# EAGLE design Old Shutter Driver with DMUX (EAGLE 9.0.0)
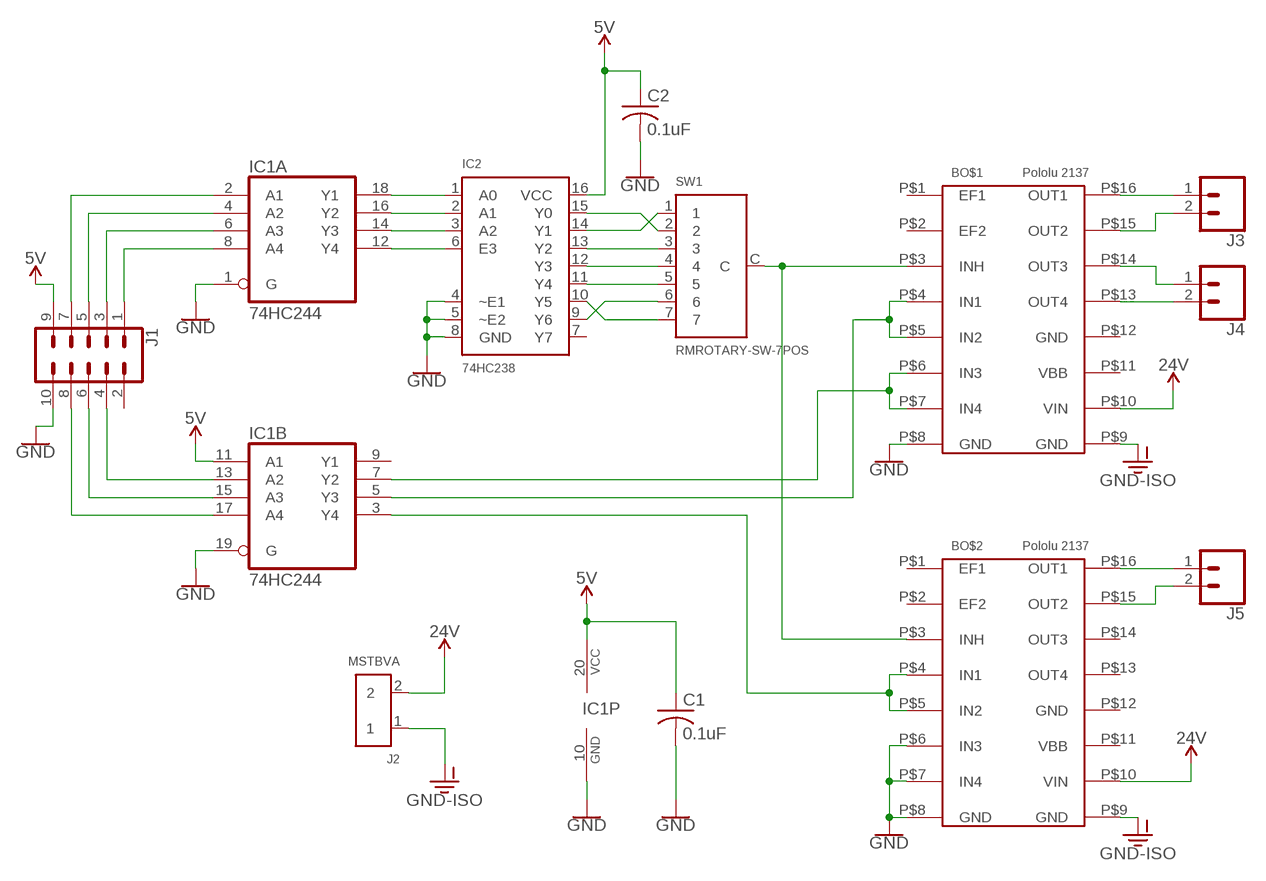
[diagram p0: schematic, sheet 1]

## Parts
BO$1  Pololu 2137  POLOLU2137  [POLOLU2137]
BO$2  Pololu 2137  POLOLU2137  [POLOLU2137]
C1  0.1uF  C-USC0805  [C0805]
C2  0.1uF  C-USC0805  [C0805]
IC1  74HC244  74LS244DW  [SO20W]
IC2  74HC238  [SO16]
J1  CONN_05X2SHD_LOCK  [2X5-SHROUDED_LOCK]
J2  MSTBVA  [MSTBVA]
J3  CONN_02POLAR_LOCK  [MOLEX-1X2_LOCK]
J4  CONN_02POLAR_LOCK  [MOLEX-1X2_LOCK]
J5  CONN_02POLAR_LOCK  [MOLEX-1X2_LOCK]
SW1  RMROTARY-SW-7POS  [RMROTARY-SW-7POS]

## Nets
5V: C1.1 C2.1 IC1.11(B:A1) IC1.20(P:VCC) IC2.16(VCC) J1.9
24V [power]: BO$1.P$10(VIN) BO$2.P$10(VIN) J2.2
GND: BO$1.P$8(GND) BO$2.P$6(IN3) BO$2.P$7(IN4) BO$2.P$8(GND) C1.2 C2.2 IC1.1(A:G) IC1.10(P:GND) IC1.19(B:G) IC2.4(~E1) IC2.5(~E2) IC2.8(GND) J1.10
GND-ISO [power]: BO$1.P$9(GND) BO$2.P$9(GND) J2.1
IN1+2: BO$2.P$4(IN1) BO$2.P$5(IN2) IC1.3(B:Y4)
INH: BO$1.P$3(INH) BO$2.P$3(INH) SW1.C
INH1+2: BO$1.P$6(IN3) BO$1.P$7(IN4) IC1.7(B:Y2)
N$1 [power]: BO$1.P$13(OUT4) J4.2
N$2 [power]: BO$1.P$14(OUT3) J4.1
N$3: IC2.15(Y0) SW1.2
N$4 [power]: BO$1.P$15(OUT2) J3.2
N$5 [power]: BO$1.P$16(OUT1) J3.1
N$6: IC2.14(Y1) SW1.1
N$7: IC2.10(Y5) SW1.7
N$8: IC2.9(Y6) SW1.6
N$9: IC2.13(Y2) SW1.3
N$10: IC2.12(Y3) SW1.4
N$11 [power]: BO$2.P$15(OUT2) J5.2
N$12 [power]: BO$2.P$16(OUT1) J5.1
N$13: BO$1.P$4(IN1) BO$1.P$5(IN2) IC1.5(B:Y3)
N$15: IC2.11(Y4) SW1.5
N$16: IC1.18(A:Y1) IC2.1(A0)
N$17: IC1.16(A:Y2) IC2.2(A1)
N$18: IC1.14(A:Y3) IC2.3(A2)
N$19: IC1.12(A:Y4) IC2.6(E3)
N$21: IC1.2(A:A1) J1.7
N$22: IC1.4(A:A2) J1.5
N$23: IC1.6(A:A3) J1.3
N$24: IC1.8(A:A4) J1.1
N$25: IC1.17(B:A4) J1.8
N$26: IC1.15(B:A3) J1.6
N$27: IC1.13(B:A2) J1.4
Unconnected: BO$1.P$1(EF1) BO$1.P$2(EF2) BO$1.P$11(VBB) BO$2.P$1(EF1) BO$2.P$2(EF2) BO$2.P$11(VBB) BO$2.P$13(OUT4) BO$2.P$14(OUT3) IC1.9(B:Y1) IC2.7(Y7) J1.2

## Power pins joined to a net without a drawn wire
GND: BO$1.P$12(GND) BO$2.P$12(GND)

## Library data of the parts
BO$1 BO$2 = AU:POLOLU2137: Pololu item #2137 - Dual H-Bridge motor driver Details: Allegro A4990 controller DC motors 6 V to 32 V, 0.7 A each Peak current 0.9 A Inputs 3V and 5V compatible $5.95 each in November 2014 from pololu.com
C1 C2 = rcl:C-US: CAPACITOR, American symbol; SPICEPREFIX: C
IC1 = AU:74*244: Octal BUFFER and LINE DRIVER, 3-state
IC2 = AU:74HC238
J1 = SparkFun-Connectors:CONN_05X2: Multi connection point. Often used as Generic Header-pin footprint for 0.1 inch spaced/style header connections For AVR SPI programming port, see special device with nice symbol: "AVR_SPI_PROG_5x2.dev" You can populate with any combo of single row headers, but if you'd like an exact match, check these: 2x5 AVR ICSP Male Header <https://www.sparkfun.com/products/778> (PRT-00778) 2x5 Pin Shrouded Header <https://www.sparkfun.com/products/8506> (PRT-08506) On any of the 0.1 inch spaced packages, you can populate with these: Break Away Headers - Straight <https://www.sparkfun.com/products/116> (PRT-00116) Break Away Male Headers - Right Angle <https://www.sparkfun.com/products/553> (PRT-00553) Female Headers <https://www.sparkfun.com/products/115> (PRT-00115) Break Away Headers - Machine Pin <https://www.sparkfun.com/products/117> (PRT-00117) Break Away Female Headers - Swiss Machine Pin <https://www.sparkfun.com/products/743> (PRT-00743) Special note: the shrouded connector mates well with our 5x2 ribbon cables: 2x5 Pin IDC Ribbon Cable <https://www.sparkfun.com/products/8535> (PRT-08535); PROD_ID: CONN-08671; SF_ID: PRT-08506
J2 = AU:MSTBVA: Phoenix Contact MSTBVA Vertical Terminal Block Phoenix order number 1755736 Digikey: 277-1150-ND Mating part is Phoneix Contact Combicon Spring Cage plug TFCK 5.08 mm pitch Digikey: 277-6941-ND
J3-J5 = SparkFun-Connectors:CONN_02: Multi connection point. Often used as Generic Header-pin footprint for 0.1 inch spaced/style header connections On any of the 0.1 inch spaced packages, you can populate with these: Break Away Headers - Straight <https://www.sparkfun.com/products/116> (PRT-00116) Break Away Male Headers - Right Angle <https://www.sparkfun.com/products/553> (PRT-00553) Female Headers <https://www.sparkfun.com/products/115> (PRT-00115) Break Away Headers - Machine Pin <https://www.sparkfun.com/products/117> (PRT-00117) Break Away Female Headers - Swiss Machine Pin <https://www.sparkfun.com/products/743> (PRT-00743) For SCREWTERMINALS and SPRING TERMINALS visit here: Screw Terimnals on SparkFun.com <https://www.sparkfun.com/search/results?term=Screw+Terminals> (5mm/3.5mm/2.54mm spacing) This device is also useful as a general connection point to wire up your design to another part of your project. Our various solder wires solder well into these plated through hole pads. Hook-Up Wire - Assortment (Stranded, 22 AWG) <https://www.sparkfun.com/products/11375> (PRT-11375) Hook-Up Wire - Assortment (Solid Core, 22 AWG) <https://www.sparkfun.com/products/11367> (PRT-11367) View the entire wire category on our website here <https://www.sparkfun.com/categories/141> Special notes: Molex polarized connector foot print use with: PRT-08233 with associated crimp pins and housings. 2.54_SCREWTERM for use with PRT-10571. 3.5mm Screw Terminal footprints for PRT-08084 5mm Screw Terminal footprints for use with PRT-08432; SF_ID: PRT-09918
SW1 = AU:RMROTARY-SW-7POS

## Net classes
1 power: width 0.508 mm, drill 0.762 mm, clearance 0.254 mm

## Board
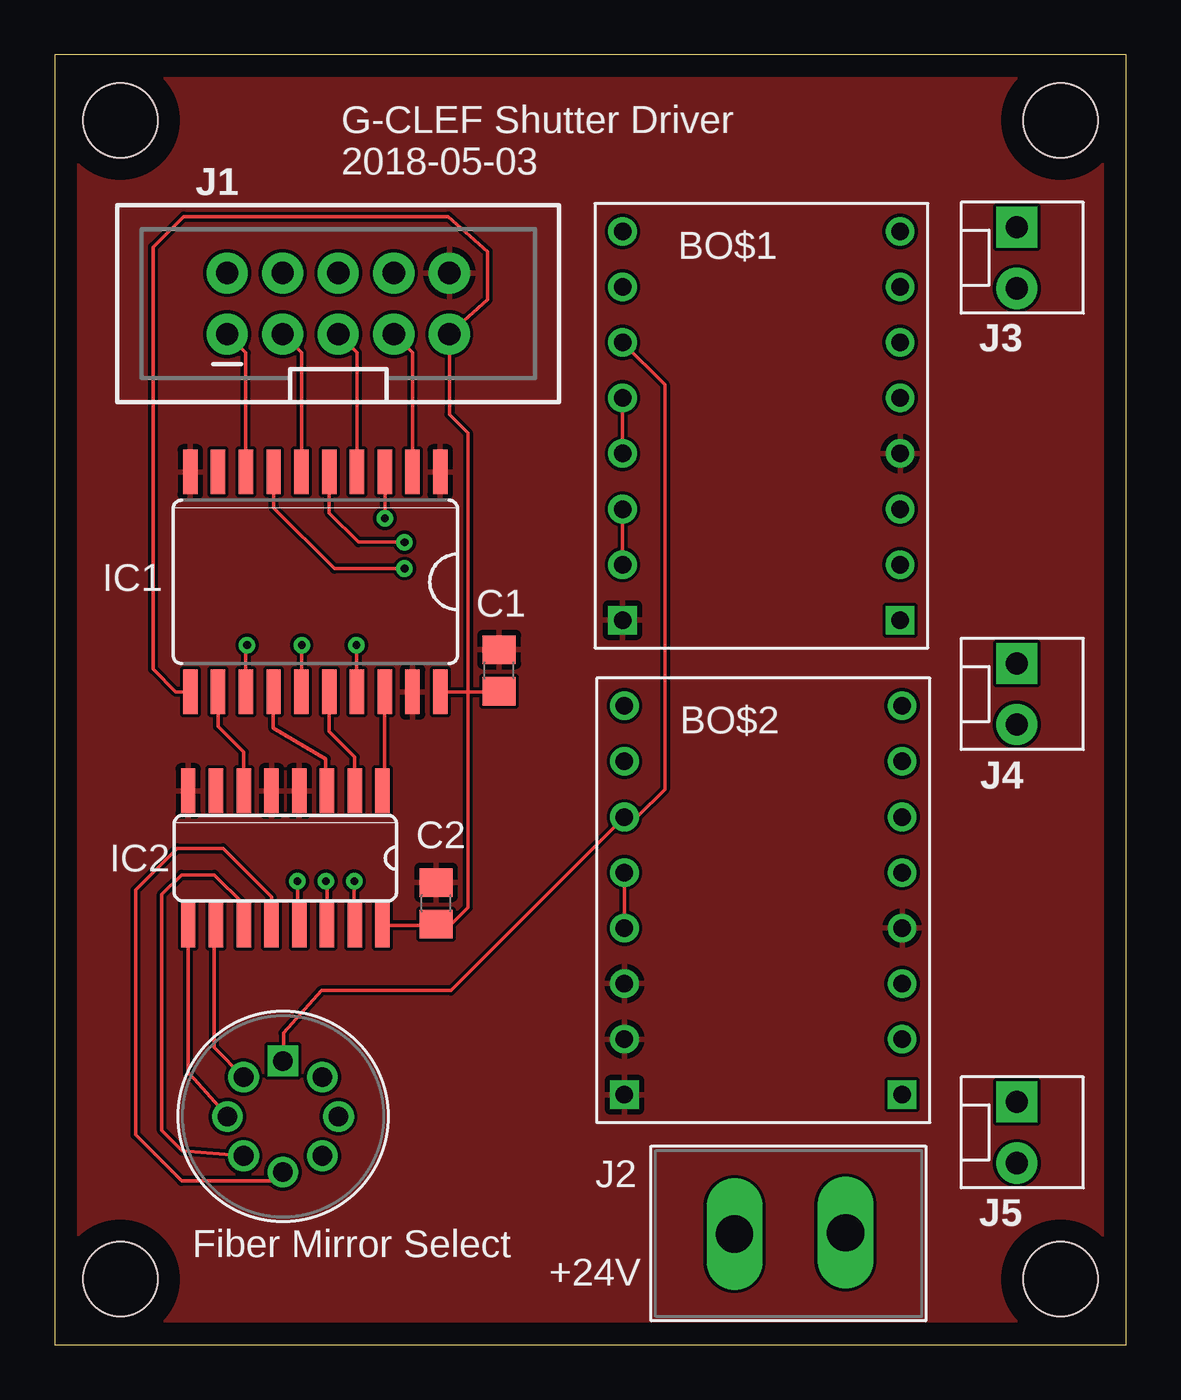
[diagram p1: board, top side]
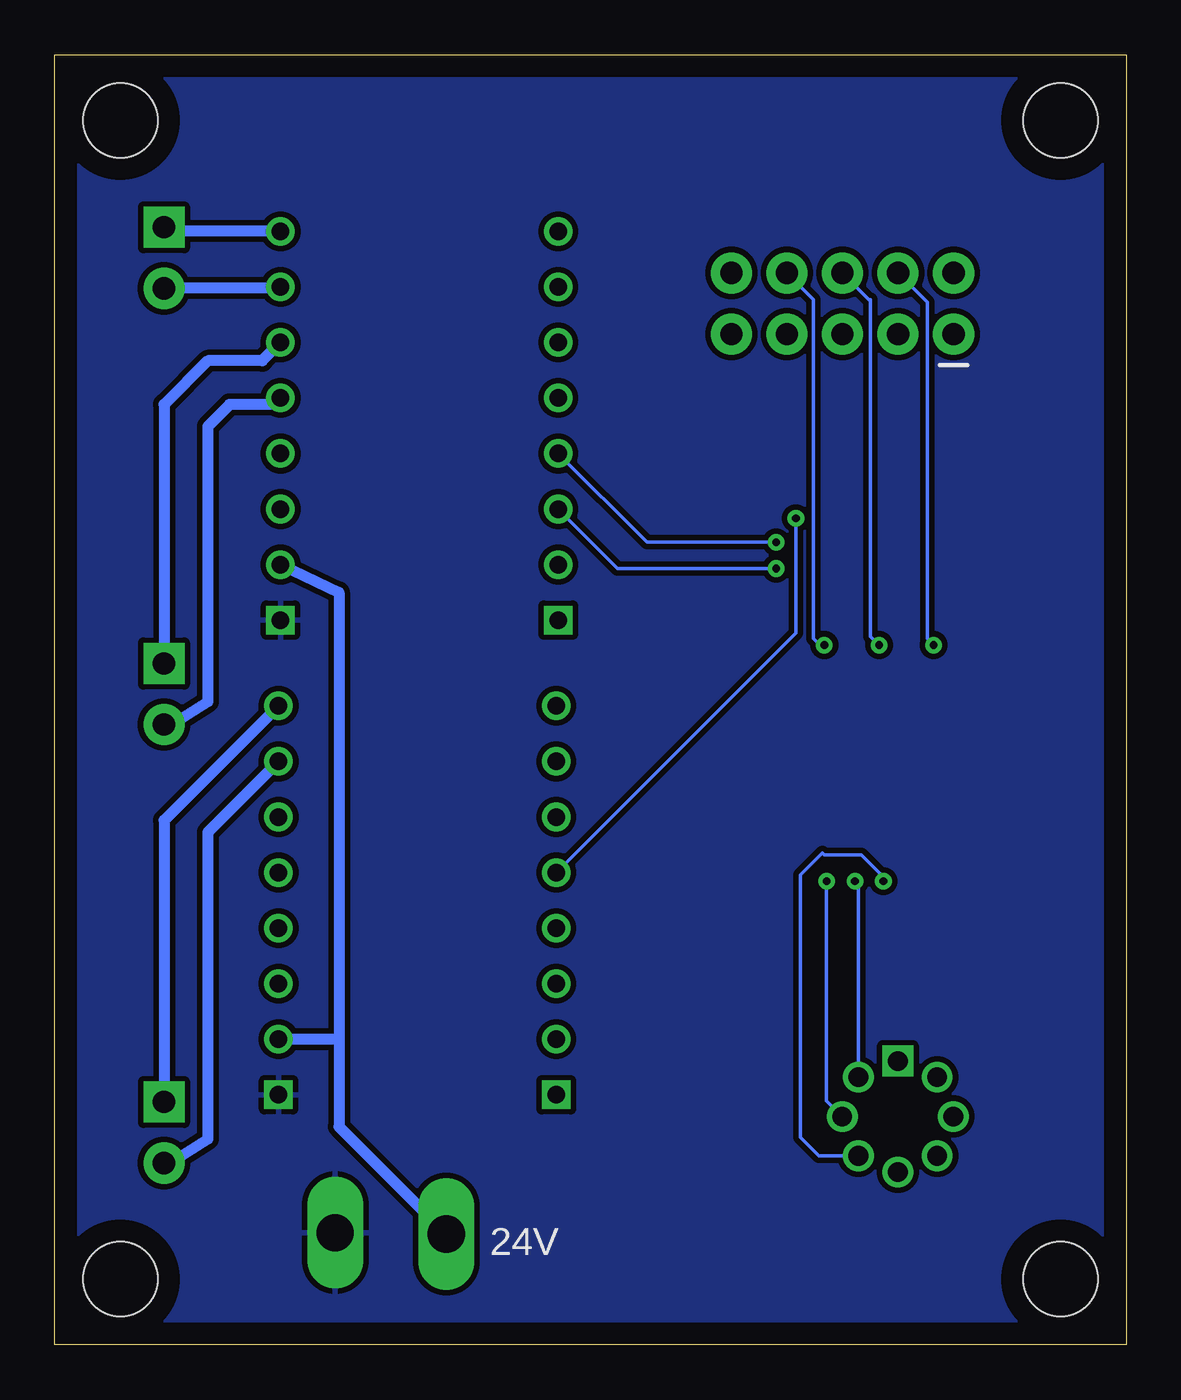
[diagram p2: board, bottom side, seen from below]

Size 49 x 59 mm. Coordinates in mm from the lower left corner, seen from the top.
Outline: 0,0 49,0 49,59 0,59 0,0
Copper layers (1*16): Top 0.035mm / dielectric 1.5mm / Bottom 0.035mm
Design rules "default": minimum track width 6mil, minimum drill 0.35mm, track to track 6mil, track to pad 6mil, pad to pad 6mil, via to via 6mil, smd to smd 6mil, copper to edge 40mil, drill to drill 6mil, minimum pad ring 10mil, minimum via ring 8mil, stop-mask expansion 4mil, vias tented up to drill 0mil, thermal gap 10mil
Holes 3.4 mm at 3,3 3,56 46,56 46,3

### Footprints (pad centres in the part's own frame; a part is rotated, then mirrored left to right if it is on the bottom)
POLOLU2137 = drill 0.8: P$1 -6.35,8.89; P$2 -6.35,6.35; P$3 -6.35,3.81; P$4 -6.35,1.27; P$5 -6.35,-1.27; P$6 -6.35,-3.81; P$7 -6.35,-6.35; P$10 6.35,-6.35; P$11 6.35,-3.81; P$12 6.35,-1.27; P$13 6.35,1.27; P$14 6.35,3.81; P$15 6.35,6.35; P$16 6.35,8.89 | drill 0.8 square: P$8 -6.35,-8.89; P$9 6.35,-8.89
C0805 = smd 1.3 x 1.5: 1 -0.95,0; 2 0.95,0
SO20W = smd 0.66 x 2.032: 1 -5.715,-5.029; 2 -4.445,-5.029; 3 -3.175,-5.029; 4 -1.905,-5.029; 5 -0.635,-5.029; 6 0.635,-5.029; 7 1.905,-5.029; 8 3.175,-5.029; 9 4.445,-5.029; 10 5.715,-5.029; 11 5.715,5.029; 12 4.445,5.029; 13 3.175,5.029; 14 1.905,5.029; 15 0.635,5.029; 16 -0.635,5.029; 17 -1.905,5.029; 18 -3.175,5.029; 19 -4.445,5.029; 20 -5.715,5.029
SO16 = smd 0.66 x 2.032: 1 -4.445,-3.073; 2 -3.175,-3.073; 3 -1.905,-3.073; 4 -0.635,-3.073; 5 0.635,-3.073; 6 1.905,-3.073; 7 3.175,-3.073; 8 4.445,-3.073; 9 4.445,3.073; 10 3.175,3.073; 11 1.905,3.073; 12 0.635,3.073; 13 -0.635,3.073; 14 -1.905,3.073; 15 -3.175,3.073; 16 -4.445,3.073
2X5-SHROUDED_LOCK = drill 1.016 pad 1.88: 1 -1.397,5.08; 2 1.397,5.08; 3 -1.397,2.54; 4 1.397,2.54; 5 -1.397,0; 6 1.397,0; 7 -1.397,-2.54; 8 1.397,-2.54; 9 -1.397,-5.08; 10 1.397,-5.08
MSTBVA = drill 1.7 long: 1 -2.61,-0.04; 2 2.47,0.02
MOLEX-1X2_LOCK = drill 1.016 pad 1.88 square: 1 -0.127,0 | drill 1.016 pad 1.88: 2 2.667,0
RMROTARY-SW-7POS = drill 0.9: 1 1.8,1.8; 2 2.54,0; 3 1.8,-1.8; 4 0,-2.54; 5 -1.8,-1.8; 6 -2.54,0; 7 -1.8,1.8 | drill 0.9 square: C 0,2.54

### Placement (x,y rotation side)
BO$1  32.32,42.03 0 top
BO$2  32.41,20.33 0 top
C1  20.33,30.84 90 top
C2  17.44,20.19 90 top
IC1  11.92,34.89 180 top
IC2  10.55,22.26 180 top
J1  12.97,47.62 90 top
J2  33.56,5.09 180 top
J3  44,50.98 270 top
J4  44,31.03 270 top
J5  44,10.98 270 top
SW1  10.44,10.44 0 top

### Tracks (layer width: path | path; a pad name or v marks a point on that pad's centre or on a via)
5V
  Top 0.152: IC1.20 18.9,29.86 | 18.9,29.86 20.3,29.86 C1.1 | IC2.16 17.39,19.19 C2.1 18.14,19.24 18.9,20 18.9,29.86 | 18.9,29.86 18.9,41.7 18.05,42.55 J1.9 18.05,46.25 19.8,47.8 19.8,50 18,51.6 5.9,51.6 4.5,50.2 4.5,30.9 5.54,29.86 IC1.11
24V
  Bottom 0.508: BO$1.P$10 36,34.41 36,14.1 | J2.2 36,9.98 36,14.1 | BO$2.P$10 36.12,13.98 36,14.1
GND
  pour Top: -1,60 50,60 50,-1 -1,-1
GND-ISO
  pour Bottom: -1,60 50,60 50,-1 -1,-1
IN1+2  (via drill 0.35)
  Top 0.152: BO$2.P$5 BO$2.P$4 | v15.1,37.8 IC1.3
  Bottom 0.152: BO$2.P$4 15.1,32.56 v15.1,37.8
INH
  Top 0.152: BO$1.P$3 27.9,43.91 27.9,25.4 26.64,24.14 BO$2.P$3 18.12,16.2 12.2,16.2 10.46,14.26 SW1.C
INH1+2  (via drill 0.35)
  Top 0.152: BO$1.P$6 BO$1.P$7 | v16,35.5 12.8,35.5 10,38.3 10.02,38.31 IC1.7
  Bottom 0.152: BO$1.P$6 23.25,35.5 v16,35.5
N$1
  Bottom 0.508: BO$1.P$13 38.97,43 41,43 42,42 42,29.4 43.64,28.36 J4.2
N$2
  Bottom 0.508: BO$1.P$14 39.51,45 42,45 44,43 J4.1
N$3  (via drill 0.35)
  Top 0.152: 13.7,19.16 IC2.15 13.7,19.21 v13.7,21.2
  Bottom 0.152: SW1.2 13.7,11.16 v13.7,21.2
N$4
  Bottom 0.508: BO$1.P$15 38.74,48.31 J3.2
N$5
  Bottom 0.508: BO$1.P$16 43.81,50.92 J3.1
N$6  (via drill 0.35)
  Top 0.152: 12.4,19.13 IC2.14 12.46,21.14 v12.4,21.2
  Bottom 0.152: SW1.1 12.24,21.04 v12.4,21.2
N$7
  Top 0.152: 7.4,19.21 IC2.10 7.3,19.11 7.3,13.6 SW1.7
N$8
  Top 0.152: SW1.6 6.18,12.4 6.1,12.4 IC2.9
N$9  (via drill 0.35)
  Top 0.152: v11.1,21.2 11.1,19.27 IC2.13
  Bottom 0.152: SW1.3 14.04,8.64 14.9,9.5 14.9,21.5 13.9,22.5 13.8,22.4 12.1,22.4 11.1,21.4 v11.1,21.2
N$10
  Top 0.152: 9.9,19.17 IC2.12 9.91,20.48 7.7,22.7 5.6,22.7 3.7,20.8 3.7,9.6 5.8,7.5 9.86,7.5 SW1.4
N$11
  Bottom 0.508: BO$2.P$15 42,23.44 42,9.4 43.69,8.31 J5.2
N$12
  Bottom 0.508: BO$2.P$16 44,23.98 J5.1
N$13  (via drill 0.35)
  Top 0.152: BO$1.P$4 BO$1.P$5 | v16,36.7 13.9,36.7 12.55,38.05 IC1.5
  Bottom 0.152: BO$1.P$5 21.91,36.7 v16,36.7
N$15
  Top 0.152: SW1.5 5.82,8.88 4.9,9.8 4.9,20.6 5.8,21.5 7.3,21.5 8.64,20.16 IC2.11
N$16
  Top 0.152: IC2.1 15.1,25.43 IC1.18
N$17
  Top 0.152: IC2.2 13.72,26.88 12.55,28.05 IC1.16
N$18
  Top 0.152: IC1.14 10,29.85 10,28.2 12.4,26.8 12.4,25.39 IC2.3
N$19
  Top 0.152: IC2.6 8.64,27.11 7.47,28.27 IC1.12
N$21
  Top 0.152: IC1.2 16.36,45.37 J1.7
N$22
  Top 0.152: IC1.4 13.82,45.37 J1.5
N$23
  Top 0.152: IC1.6 11.29,45.37 J1.3
N$24
  Top 0.152: IC1.8 8.74,45.37 J1.1
N$25  (via drill 0.35)
  Top 0.152: v13.8,32 13.8,29.89 IC1.17
  Bottom 0.152: J1.8 14.3,47.81 14.3,32.3 14,32 v13.8,32
N$26  (via drill 0.35)
  Top 0.152: v11.3,32 11.3,29.88 IC1.15
  Bottom 0.152: J1.6 11.75,47.8 11.7,47.8 11.7,32.4 v11.3,32
N$27  (via drill 0.35)
  Top 0.152: v8.8,32 8.74,31.95 IC1.13
  Bottom 0.152: J1.4 9.1,47.69 9.1,32.3 v8.8,32

### Text on the board
tNames: G-CLEF Shutter Driver / 2018-05-03 | Fiber Mirror Select | +24V
bNames: 24V